# EAGLE schematic Schematic_part2 (EAGLE 9.7.0)

## Sheet 1 of 3
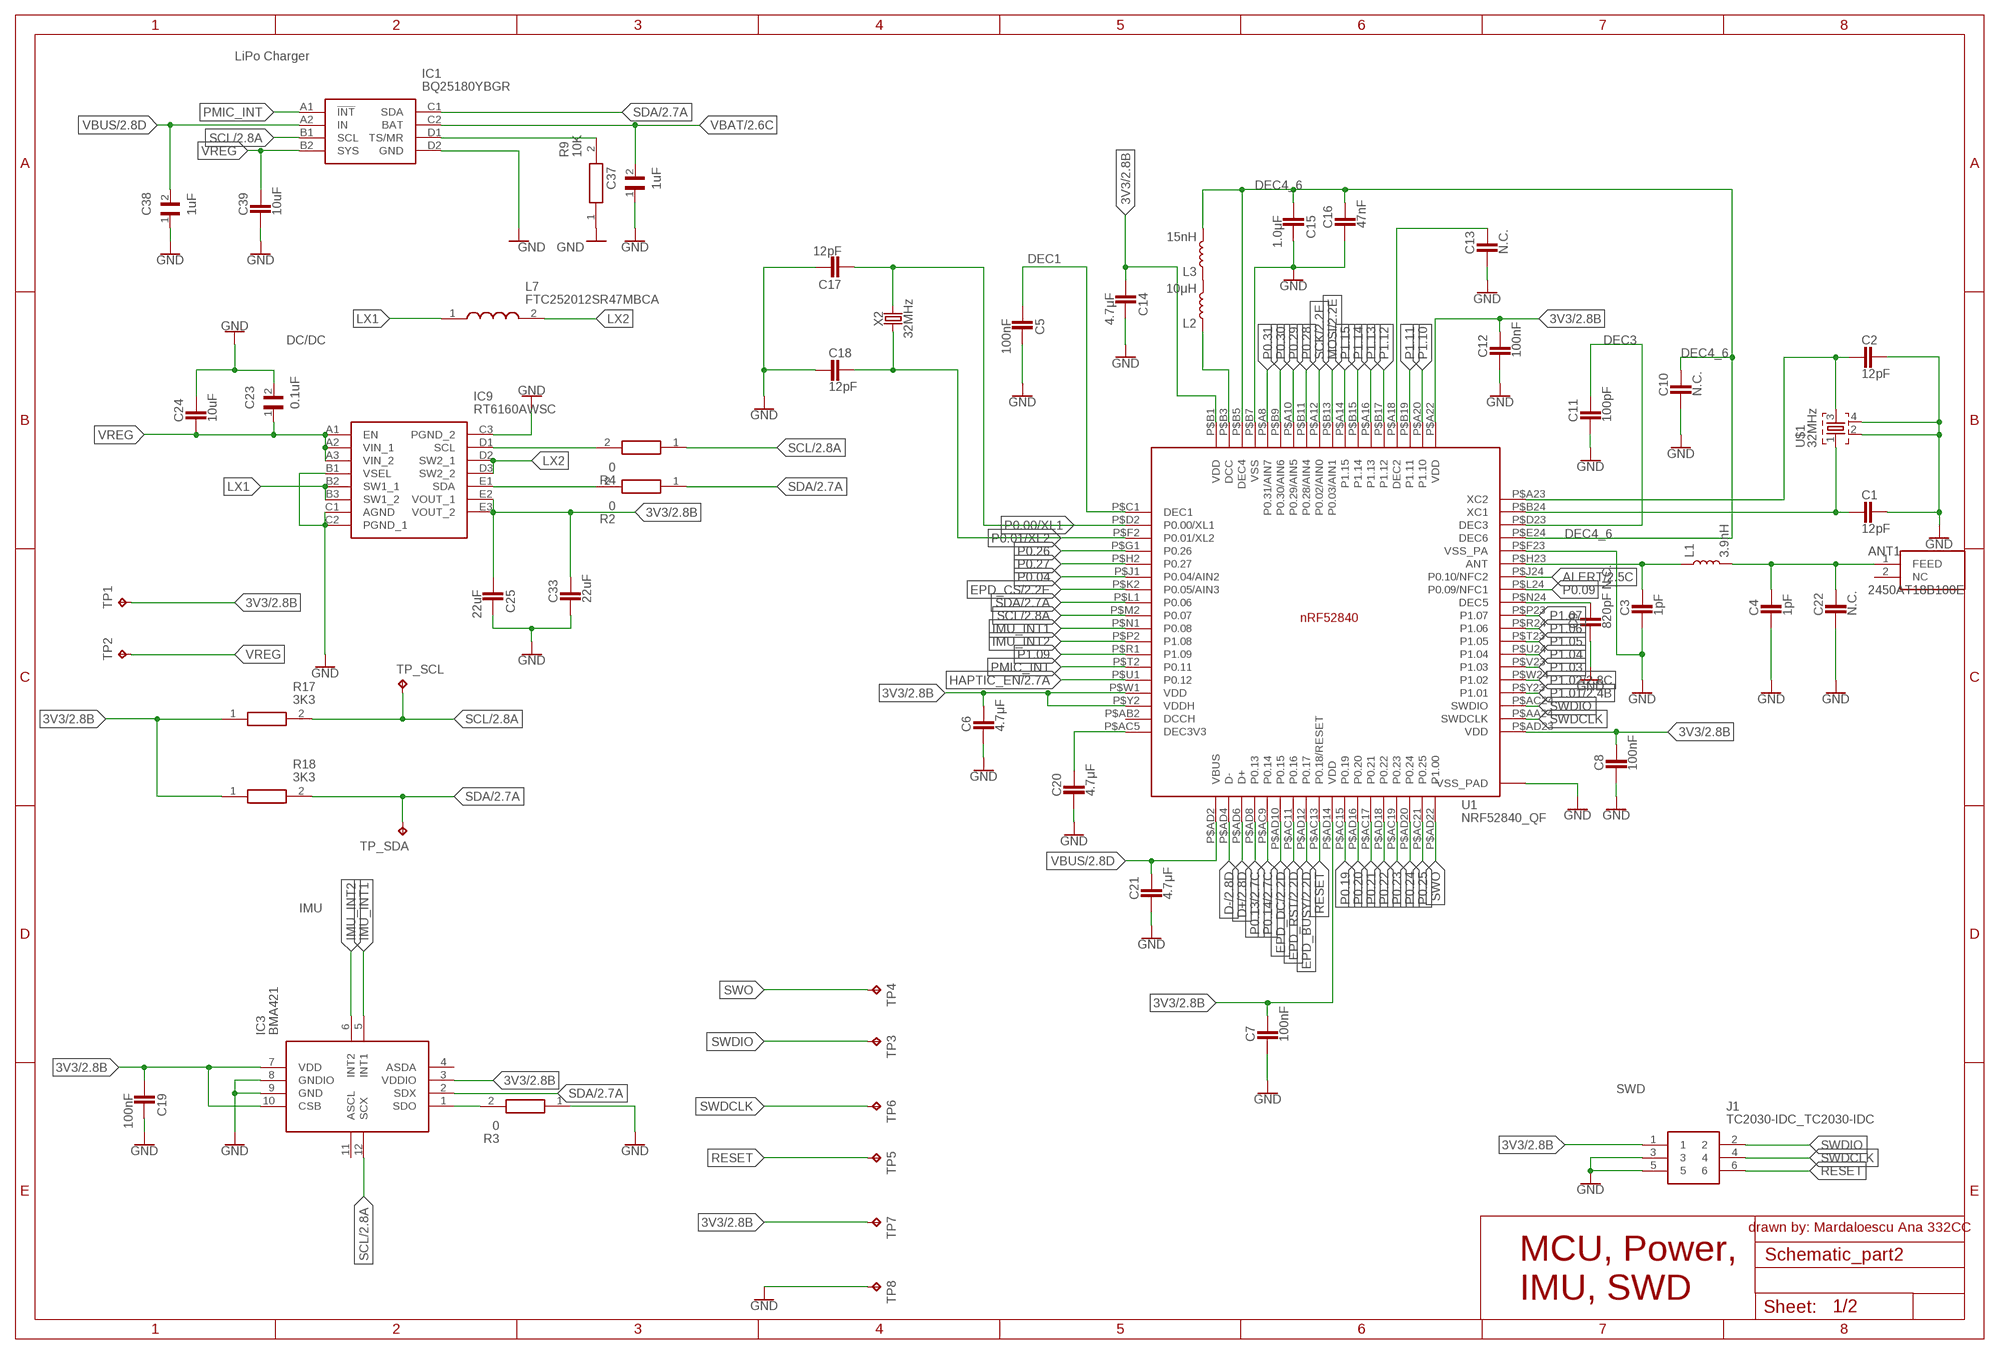
[diagram p0: schematic, sheet 1]

### Parts
ANT1  2450AT18B100E  2450AT18B100E_2450AT18B100E  [2450AT18B100E_ANTC3216X140N]
C1  12pF  CAPACITOR_CHIP-0402(1005-METRIC)  [CAPC1005X60]
C2  12pF  CAPACITOR_CHIP-0402(1005-METRIC)  [CAPC1005X60]
C3  1pF  CAPACITOR_CHIP-0402(1005-METRIC)  [CAPC1005X60]
C4  1pF  CAPACITOR_CHIP-0402(1005-METRIC)  [CAPC1005X60]
C5  100nF  CAPACITOR_CHIP-0402(1005-METRIC)  [CAPC1005X60]
C6  4.7μF  CAPACITOR_CHIP-0402(1005-METRIC)  [CAPC1005X60]
C7  100nF  CAPACITOR_CHIP-0402(1005-METRIC)  [CAPC1005X60]
C8  100nF  CAPACITOR_CHIP-0402(1005-METRIC)  [CAPC1005X60]
C9  820pF N.C.  CAPACITOR_CHIP-0402(1005-METRIC)  [CAPC1005X60]
C10  N.C.  CAPACITOR_CHIP-0402(1005-METRIC)  [CAPC1005X60]
C11  100pF  CAPACITOR_CHIP-0402(1005-METRIC)  [CAPC1005X60]
C12  100nF  CAPACITOR_CHIP-0402(1005-METRIC)  [CAPC1005X60]
C13  N.C.  CAPACITOR_CHIP-0402(1005-METRIC)  [CAPC1005X60]
C14  4.7μF  CAPACITOR_CHIP-0402(1005-METRIC)  [CAPC1005X60]
C15  1.0μF  CAPACITOR_CHIP-0402(1005-METRIC)  [CAPC1005X60]
C16  47nF  CAPACITOR_CHIP-0402(1005-METRIC)  [CAPC1005X60]
C17  12pF  CAPACITOR_CHIP-0402(1005-METRIC)  [CAPC1005X60]
C18  12pF  CAPACITOR_CHIP-0402(1005-METRIC)  [CAPC1005X60]
C19  100nF  CAPACITOR_CHIP-0402(1005-METRIC)  [CAPC1005X60]
C20  4.7μF  CAPACITOR_CHIP-0402(1005-METRIC)  [CAPC1005X60]
C21  4.7μF  CAPACITOR_CHIP-0402(1005-METRIC)  [CAPC1005X60]
C22  N.C.  CAPACITOR_CHIP-0402(1005-METRIC)  [CAPC1005X60]
C23  0.1uF  GRM011R60J152KE01L_1_GRM011R60J152KE01L  [GRM011R60J152KE01L_1_0201]
C24  10uF  CAPACITOR_CHIP-0402(1005-METRIC)  [CAPC1005X60]
C25  22uF  CAPACITOR_CHIP-0402(1005-METRIC)  [CAPC1005X60]
C33  22uF  CAPACITOR_CHIP-0402(1005-METRIC)  [CAPC1005X60]
C37  1uF  GRM011R60J152KE01L_1_GRM011R60J152KE01L  [GRM011R60J152KE01L_1_0201]
C38  1uF  GRM011R60J152KE01L_1_GRM011R60J152KE01L  [GRM011R60J152KE01L_1_0201]
C39  10uF  CAPACITOR_CHIP-0402(1005-METRIC)  [CAPC1005X60]
IC1  BQ25180YBGR  BQ25180YBGR_BQ25180YBGR  [BQ25180YBGR_BGA8C40P2X4_100X155X50]
IC3  BMA421  BMA423_BMA423  [BMA423_BMA423]
IC9  RT6160AWSC  RT6160AWSC_RT6160AWSC  [RT6160AWSC_BGA15C40P3X5_140X230X60]
J1  TC2030-IDC_TC2030-IDC  [TC2030-IDC_TC2030IDC]
L1  3.9nH  1.0μH-0805_WIDE-1.0μH-1.4A-0.07OHM-1.4MM_H  [0805-WIDE]
L2  10μH  1.0μH-0805_WIDE-1.0μH-1.4A-0.07OHM-1.4MM_H  [0805-WIDE]
L3  15nH  1.0μH-0805_WIDE-1.0μH-1.4A-0.07OHM-1.4MM_H  [0805-WIDE]
L7  FTC252012SR47MBCA  MLP2016SR47MT0S1_FTC252012SR47MBCA  [MLP2016SR47MT0S1_INDC2016X100N]
R2  0  CPF0201D7K68C1_CPF0201D7K68C1  [CPF0201D7K68C1_0201]
R3  0  CPF0201D7K68C1_CPF0201D7K68C1  [CPF0201D7K68C1_0201]
R4  0  CPF0201D7K68C1_CPF0201D7K68C1  [CPF0201D7K68C1_0201]
R9  10K  CPF0201D7K68C1_CPF0201D7K68C1  [CPF0201D7K68C1_0201]
R17  3K3  CPF0201D7K68C1_CPF0201D7K68C1  [CPF0201D7K68C1_0201]
R18  3K3  CPF0201D7K68C1_CPF0201D7K68C1  [CPF0201D7K68C1_0201]
TP1  HECTOR_WATCH_1_TPTP20R  [HECTOR_WATCH_1_TP20R]
TP2  HECTOR_WATCH_1_TPTP20R  [HECTOR_WATCH_1_TP20R]
TP3  HECTOR_WATCH_1_TPTP20R  [HECTOR_WATCH_1_TP20R]
TP4  HECTOR_WATCH_1_TPTP20R  [HECTOR_WATCH_1_TP20R]
TP5  HECTOR_WATCH_1_TPTP20R  [HECTOR_WATCH_1_TP20R]
TP6  HECTOR_WATCH_1_TPTP20R  [HECTOR_WATCH_1_TP20R]
TP7  HECTOR_WATCH_1_TPTP20R  [HECTOR_WATCH_1_TP20R]
TP8  HECTOR_WATCH_1_TPTP20R  [HECTOR_WATCH_1_TP20R]
TP_SCL  HECTOR_WATCH_1_TPTP20R  [HECTOR_WATCH_1_TP20R]
TP_SDA  HECTOR_WATCH_1_TPTP20R  [HECTOR_WATCH_1_TP20R]
U1  NRF52840_QF  NORDIC_NRF_4_NRF52840_QF  [NORDIC_NRF_4_AQFN50P700X700X85_HS-74N]
U$1  32MHz  NORDIC_NRF_XTAL_32MHZ  [NORDIC_NRF_BT-XTAL_2016_N]
X2  32MHz  CRYSTAL-32MHZ-SMD-2.0X1.6MM  [CRYSTAL-SMD-2.0X1.6MM]

### Nets
3V3: C6.1 C7.1 C8.1 C12.1 C14.2 C19.2 C25.2 C33.1 IC3.3(VDDIO) IC3.7(VDD) IC3.10(CSB) IC9.E2(VOUT_1) IC9.E3(VOUT_2) J1.1 R17.1 R18.1 TP1.TP TP7.TP U1.P$A22(VDD) U1.P$AD14(VDD) U1.P$AD23(VDD) U1.P$B1(VDD) U1.P$W1(VDD) U1.P$Y2(VDDH) ; also sheet 2
ALERT: U1.P$J24(P0.10/NFC2) ; also sheet 2
D+: U1.P$AD6(D+) ; also sheet 2
D-: U1.P$AD4(D-) ; also sheet 2
DEC1: C5.2 U1.P$C1(DEC1)
DEC3: C11.1 U1.P$D23(DEC3)
DEC4_6: C10.1 C15.2 C16.1 L3.2 U1.P$B5(DEC4) U1.P$E24(DEC6)
EPD_BUSY: U1.P$AD12(P0.17) ; also sheet 2
EPD_CS: U1.P$K2(P0.05/AIN3) ; also sheet 2
EPD_DC: U1.P$AD10(P0.15) ; also sheet 2
EPD_RST: U1.P$AC11(P0.16) ; also sheet 2
GND: C1.1 C2.1 C3.2 C4.2 C5.1 C6.2 C7.2 C8.2 C9.2 C10.2 C11.2 C12.2 C13.2 C14.1 C15.1 C16.2 C17.1 C18.2 C19.1 C20.2 C21.2 C22.2 C23.2 C24.1 C25.1 C33.2 C37.1 C38.1 C39.2 IC1.D2(GND) IC3.8(GNDIO) IC3.9(GND) IC9.B1(VSEL) IC9.C1(AGND) IC9.C2(PGND_1) IC9.C3(PGND_2) J1.3 J1.5 R3.1 R9.1 TP8.TP U1.P$74(VSS_PAD) U1.P$75(VSS_PAD) U1.P$76(VSS_PAD) U1.P$77(VSS_PAD) U1.P$78(VSS_PAD) U1.P$79(VSS_PAD) U1.P$80(VSS_PAD) U1.P$81(VSS_PAD) U1.P$82(VSS_PAD) U1.P$83(VSS_PAD) U1.P$84(VSS_PAD) U1.P$85(VSS_PAD) U1.P$86(VSS_PAD) U1.P$87(VSS_PAD) U1.P$88(VSS_PAD) U1.P$89(VSS_PAD) U1.P$90(VSS_PAD) U1.P$B7(VSS) U1.P$F23(VSS_PA) U$1.2 U$1.4 ; also sheet 2
HAPTIC_EN: U1.P$U1(P0.12) ; also sheet 2
IMU_INT1: IC3.5(INT1) U1.P$N1(P0.08)
IMU_INT2: IC3.6(INT2) U1.P$P2(P1.08)
LX1: IC9.B2(SW1_1) IC9.B3(SW1_2) L7.1
LX2: IC9.D2(SW2_1) IC9.D3(SW2_2) L7.2
MOSI: U1.P$B13(P0.03/AIN1) ; also sheet 2
N$1: IC9.D1(SCL) R4.2
N$2: IC9.E1(SDA) R2.2
N$3: IC3.1(SDO) R3.2
N$4: C3.1 L1.1 U1.P$H23(ANT)
N$5: ANT1.1(FEED) C4.1 C22.1 L1.2
N$7: IC1.D1(TS/MR) R9.2
N$10: C9.1 U1.P$N24(DEC5)
N$38: C20.1 U1.P$AC5(DEC3V3)
N$56: L2.2 L3.1
N$57: L2.1 U1.P$B3(DCC)
N$71: C13.1 U1.P$A18(DEC2)
N$74: C2.2 U1.P$A23(XC2) U$1.3
N$75: C1.2 U1.P$B24(XC1) U$1.1
P0.00/XL1: C17.2 U1.P$D2(P0.00/XL1) X2.3
P0.01/XL2: C18.1 U1.P$F2(P0.01/XL2) X2.1
P0.04: U1.P$J1(P0.04/AIN2)
P0.09: U1.P$L24(P0.09/NFC1)
P0.13: U1.P$AD8(P0.13) ; also sheet 2
P0.14: U1.P$AC9(P0.14) ; also sheet 2
P0.19: U1.P$AC15(P0.19)
P0.20: U1.P$AD16(P0.20)
P0.21: U1.P$AC17(P0.21)
P0.22: U1.P$AD18(P0.22)
P0.23: U1.P$AC19(P0.23)
P0.24: U1.P$AD20(P0.24)
P0.25: U1.P$AC21(P0.25)
P0.26: U1.P$G1(P0.26)
P0.27: U1.P$H2(P0.27)
P0.28: U1.P$B11(P0.28/AIN4)
P0.29: U1.P$A10(P0.29/AIN5)
P0.30: U1.P$B9(P0.30/AIN6)
P0.31: U1.P$A8(P0.31/AIN7)
P1.01: U1.P$Y23(P1.01) ; also sheet 2
P1.02: U1.P$W24(P1.02) ; also sheet 2
P1.03: U1.P$V23(P1.03)
P1.04: U1.P$U24(P1.04)
P1.05: U1.P$T23(P1.05)
P1.06: U1.P$R24(P1.06)
P1.07: U1.P$P23(P1.07)
P1.09: U1.P$R1(P1.09)
P1.10: U1.P$A20(P1.10)
P1.11: U1.P$B19(P1.11)
P1.12: U1.P$B17(P1.12)
P1.13: U1.P$A16(P1.13)
P1.14: U1.P$B15(P1.14)
P1.15: U1.P$A14(P1.15)
PMIC_INT: IC1.A1(!INT) U1.P$T2(P0.11)
RESET: J1.6 TP5.TP U1.P$AC13(P0.18/RESET)
SCK: U1.P$A12(P0.02/AIN0) ; also sheet 2
SCL: IC1.B1(SCL) IC3.12(SCX) R4.1 R17.2 TP_SCL.TP U1.P$M2(P0.07) ; also sheet 2
SDA: IC1.C1(SDA) IC3.2(SDX) R2.1 R18.2 TP_SDA.TP U1.P$L1(P0.06) ; also sheet 2
SWDCLK: J1.4 TP6.TP U1.P$AA24(SWDCLK)
SWDIO: J1.2 TP3.TP U1.P$AC24(SWDIO)
SWO: TP4.TP U1.P$AD22(P1.00)
VBAT: C37.2 IC1.C2(BAT) ; also sheet 2
VBUS: C21.1 C38.2 IC1.A2(IN) U1.P$AD2(VBUS) ; also sheet 2
VREG: C23.1 C24.2 C39.1 IC1.B2(SYS) IC9.A1(EN) IC9.A2(VIN_1) IC9.A3(VIN_2) TP2.TP
Unconnected: ANT1.2(NC) IC3.4(ASDA) IC3.11(ASCL) U1.P$AB2(DCCH)

### Notes on the sheet
- LiPo Charger
- DC/DC
- IMU
- SWD
- drawn by: Mardaloescu Ana 332CC
- MCU, Power,
  IMU, SWD
- Sheet: | 1/2

## Sheet 2 of 3
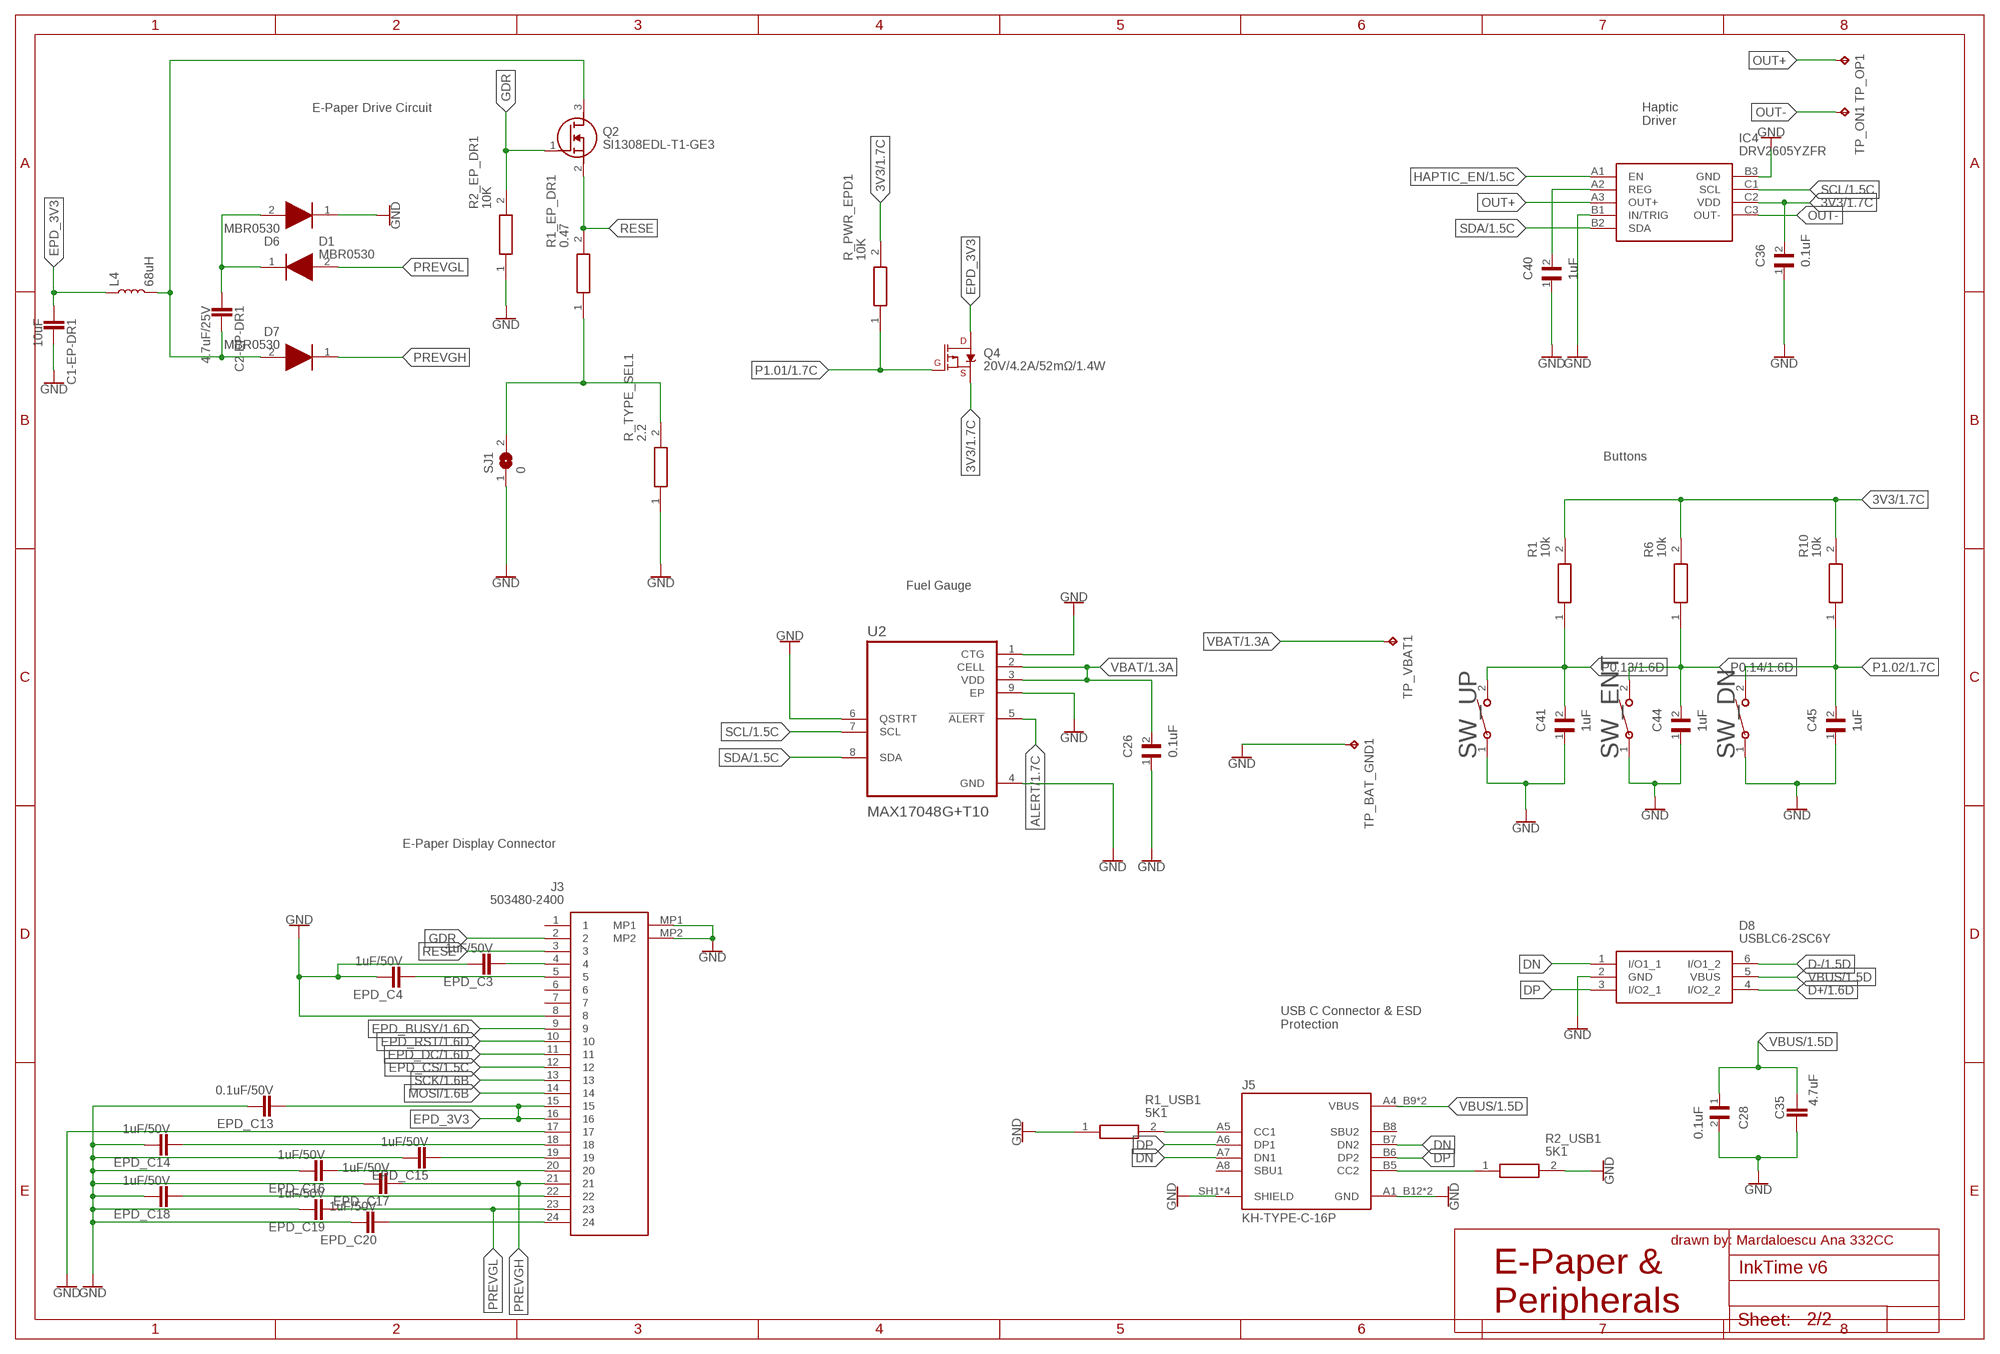
[diagram p1: schematic, sheet 2]

### Parts
C1-EP-DR1  10uF  CAPACITOR_CHIP-0402(1005-METRIC)  [CAPC1005X60]
C2-EP-DR1  4.7uF/25V  CAPACITOR_CHIP-0402(1005-METRIC)  [CAPC1005X60]
C26  0.1uF  GRM011R60J152KE01L_1_GRM011R60J152KE01L  [GRM011R60J152KE01L_1_0201]
C28  0.1uF  GRM011R60J152KE01L_1_GRM011R60J152KE01L  [GRM011R60J152KE01L_1_0201]
C35  4.7uF  CAPACITOR_CHIP-0402(1005-METRIC)  [CAPC1005X60]
C36  0.1uF  GRM011R60J152KE01L_1_GRM011R60J152KE01L  [GRM011R60J152KE01L_1_0201]
C40  1uF  GRM011R60J152KE01L_1_GRM011R60J152KE01L  [GRM011R60J152KE01L_1_0201]
C41  1uF  GRM011R60J152KE01L_1_GRM011R60J152KE01L  [GRM011R60J152KE01L_1_0201]
C44  1uF  GRM011R60J152KE01L_1_GRM011R60J152KE01L  [GRM011R60J152KE01L_1_0201]
C45  1uF  GRM011R60J152KE01L_1_GRM011R60J152KE01L  [GRM011R60J152KE01L_1_0201]
D1  MBR0530  ESP32_C6_LIBRARY_5_MBR0530  [ESP32_C6_LIBRARY_5_SOD3716X135N]
D6  MBR0530  ESP32_C6_LIBRARY_5_MBR0530  [ESP32_C6_LIBRARY_5_SOD3716X135N]
D7  MBR0530  ESP32_C6_LIBRARY_5_MBR0530  [ESP32_C6_LIBRARY_5_SOD3716X135N]
D8  USBLC6-2SC6Y  ESP32_C6_LIBRARY_3_USBLC6-2SC6Y  [ESP32_C6_LIBRARY_3_SOT95P280X145-6N]
EPD_C3  1uF/50V  CAPACITOR_CHIP-0402(1005-METRIC)  [CAPC1005X60]
EPD_C4  1uF/50V  CAPACITOR_CHIP-0402(1005-METRIC)  [CAPC1005X60]
EPD_C13  0.1uF/50V  CAPACITOR_CHIP-0402(1005-METRIC)  [CAPC1005X60]
EPD_C14  1uF/50V  CAPACITOR_CHIP-0402(1005-METRIC)  [CAPC1005X60]
EPD_C15  1uF/50V  CAPACITOR_CHIP-0402(1005-METRIC)  [CAPC1005X60]
EPD_C16  1uF/50V  CAPACITOR_CHIP-0402(1005-METRIC)  [CAPC1005X60]
EPD_C17  1uF/50V  CAPACITOR_CHIP-0402(1005-METRIC)  [CAPC1005X60]
EPD_C18  1uF/50V  CAPACITOR_CHIP-0402(1005-METRIC)  [CAPC1005X60]
EPD_C19  1uF/50V  CAPACITOR_CHIP-0402(1005-METRIC)  [CAPC1005X60]
EPD_C20  1uF/50V  CAPACITOR_CHIP-0402(1005-METRIC)  [CAPC1005X60]
IC4  DRV2605YZFR  DRV2605YZFR_DRV2605YZFR  [DRV2605YZFR_BGA9C50P3X3_144X144X62]
J3  503480-2400  503480-2400_503480-2400  [503480-2400_5034802400]
J5  KH-TYPE-C-16P  KH-TYPE-C-16P_KH-TYPE-C-16P  [KH-TYPE-C-16P_KINGHELM_KH-TYPE-C-16P]
L4  68uH  INDUCTOR-XFL40201.5UH  [XFL4020]
Q2  SI1308EDL-T1-GE3  ESP32_C6_LIBRARY_6_SI1308EDL-T1-GE3  [ESP32_C6_LIBRARY_6_SOT65P210X110-3N]
Q4  20V/4.2A/52mΩ/1.4W  ESP32_C6_LIBRARY_4_ESP32_WROVER_SPARKFUN-DISCRETESEMI_MOSFET_PCH-DMG2305UX-7  [ESP32_C6_LIBRARY_4_ESP32_C6_LIBRARY_4_ESP32_C6_LIBRARY_4_ESP32_C6_LIBRARY_4_ESP32_WROVER_SPARKFUN-DISCRETESEMI_SOT23-3]
R1  10k  CPF0201D7K68C1_CPF0201D7K68C1  [CPF0201D7K68C1_0201]
R1_EP_DR1  0.47  CPF0201D7K68C1_CPF0201D7K68C1  [CPF0201D7K68C1_0201]
R1_USB1  5K1  CPF0201D7K68C1_CPF0201D7K68C1  [CPF0201D7K68C1_0201]
R2_EP_DR1  10K  CPF0201D7K68C1_CPF0201D7K68C1  [CPF0201D7K68C1_0201]
R2_USB1  5K1  CPF0201D7K68C1_CPF0201D7K68C1  [CPF0201D7K68C1_0201]
R6  10k  CPF0201D7K68C1_CPF0201D7K68C1  [CPF0201D7K68C1_0201]
R10  10k  CPF0201D7K68C1_CPF0201D7K68C1  [CPF0201D7K68C1_0201]
R_PWR_EPD1  10K  CPF0201D7K68C1_CPF0201D7K68C1  [CPF0201D7K68C1_0201]
R_TYPE_SEL1  2.2  CPF0201D7K68C1_CPF0201D7K68C1  [CPF0201D7K68C1_0201]
SJ1  0  ESP32_C6_LIBRARY_7_JUMPER_SJ  [ESP32_C6_LIBRARY_7_JUMPER_SJ]
SW_DN  2025-10-22_07-23-44_LIBRARY_EVP-AKE31ASW_EVP-AKE31A_PAN  [2025-10-22_07-23-44_LIBRARY_SW_EVP-AKE31A_PAN]
SW_ENT  2025-10-22_07-23-44_LIBRARY_EVP-AKE31ASW_EVP-AKE31A_PAN  [2025-10-22_07-23-44_LIBRARY_SW_EVP-AKE31A_PAN]
SW_UP  2025-10-22_07-23-44_LIBRARY_EVP-AKE31ASW_EVP-AKE31A_PAN  [2025-10-22_07-23-44_LIBRARY_SW_EVP-AKE31A_PAN]
TP_BAT_GND1  HECTOR_WATCH_1_TPTP20R  [HECTOR_WATCH_1_TP20R]
TP_ON1  HECTOR_WATCH_1_TPTP20R  [HECTOR_WATCH_1_TP20R]
TP_OP1  HECTOR_WATCH_1_TPTP20R  [HECTOR_WATCH_1_TP20R]
TP_VBAT1  HECTOR_WATCH_1_TPTP20R  [HECTOR_WATCH_1_TP20R]
U2  MAX17048G+T10  ESP32_C6_LIBRARY_MAX17048G+T10  [ESP32_C6_LIBRARY_SON50P200X200X80-9N]

### Nets
3V3: C36.2 IC4.C2(VDD) Q4.2(S) R1.2 R6.2 R10.2 R_PWR_EPD1.2 ; also sheet 1
3V3/1.7D2: C40.2 IC4.A2(REG)
ALERT: U2.5(!ALERT) ; also sheet 1
D+: D8.4(I/O2_2) ; also sheet 1
D-: D8.6(I/O1_2) ; also sheet 1
DN: D8.1(I/O1_1) J5.A7(DN1) J5.B7(DN2)
DP: D8.3(I/O2_1) J5.A6(DP1) J5.B6(DP2)
EPD_3V3: C1-EP-DR1.2 EPD_C13.2 J3.15 J3.16 L4.P$1 Q4.3(D)
EPD_BUSY: J3.9 ; also sheet 1
EPD_CS: J3.12 ; also sheet 1
EPD_DC: J3.11 ; also sheet 1
EPD_RST: J3.10 ; also sheet 1
GDR: J3.2 Q2.1(G) R2_EP_DR1.2
GND: C1-EP-DR1.1 C26.1 C28.2 C35.2 C36.1 C40.1 C41.1 C44.1 C45.1 D6.1(K) D8.2(GND) EPD_C3.1 EPD_C4.1 EPD_C13.1 EPD_C14.1 EPD_C15.1 EPD_C16.1 EPD_C17.1 EPD_C18.1 EPD_C19.1 EPD_C20.1 IC4.B1(IN/TRIG) IC4.B3(GND) J3.8 J3.17 J3.MP1 J3.MP2 J5.A1_B12(GND) J5.A12_B1(GND) J5.SH1(SHIELD) J5.SH2(SHIELD) J5.SH3(SHIELD) J5.SH4(SHIELD) R1_USB1.1 R2_EP_DR1.1 R2_USB1.2 R_TYPE_SEL1.1 SJ1.1 SW_DN.1 SW_ENT.1 SW_UP.1 TP_BAT_GND1.TP U2.1(CTG) U2.4(GND) U2.6(QSTRT) U2.9(EP) ; also sheet 1
HAPTIC_EN: IC4.A1(EN) ; also sheet 1
MOSI: J3.14 ; also sheet 1
N$22: C2-EP-DR1.1 D7.2(A) L4.P$2 Q2.3(D)
N$23: R1_EP_DR1.1 R_TYPE_SEL1.2 SJ1.2
N$24: C2-EP-DR1.2 D1.1(K) D6.2(A)
N$25: EPD_C3.2 J3.4
N$26: EPD_C4.2 J3.5
N$27: EPD_C14.2 J3.18
N$28: EPD_C15.2 J3.19
N$29: EPD_C16.2 J3.20
N$30: EPD_C18.2 J3.22
N$31: EPD_C20.2 J3.24
N$32: J5.A5(CC1) R1_USB1.2
N$33: J5.B5(CC2) R2_USB1.1
OUT+: IC4.A3(OUT+) TP_OP1.TP
OUT-: IC4.C3(OUT-) TP_ON1.TP
P0.13: C41.2 R1.1 SW_UP.2 ; also sheet 1
P0.14: C44.2 R6.1 SW_ENT.2 ; also sheet 1
P1.01: Q4.1(G) R_PWR_EPD1.1 ; also sheet 1
P1.02: C45.2 R10.1 SW_DN.2 ; also sheet 1
PREVGH: D7.1(K) EPD_C17.2 J3.21
PREVGL: D1.2(A) EPD_C19.2 J3.23
RESE: J3.3 Q2.2(S) R1_EP_DR1.2
SCK: J3.13 ; also sheet 1
SCL: IC4.C1(SCL) U2.7(SCL) ; also sheet 1
SDA: IC4.B2(SDA) U2.8(SDA) ; also sheet 1
VBAT: C26.2 TP_VBAT1.TP U2.2(CELL) U2.3(VDD) ; also sheet 1
VBUS: C28.1 C35.1 D8.5(VBUS) J5.A4_B9(VBUS) J5.A9_B4(VBUS) ; also sheet 1
Unconnected: J3.1 J3.6 J3.7 J5.A8(SBU1) J5.B8(SBU2)

### Notes on the sheet
- E-Paper Drive Circuit
- Haptic
  Driver
- Buttons
- Fuel Gauge
- E-Paper Display Connector
- USB C Connector & ESD
  Protection
- drawn by: Mardaloescu Ana 332CC
- InkTime v6
- E-Paper &
  Peripherals
- Sheet: | 2/2

## Sheet 3 of 3

## Library data of the parts
ANT1 = InkTime_v5:2450AT18B100E_2450AT18B100E: Antennas 2.45GHz ANTENNA Source: Datasheet <https://www.johansontechnology.com/datasheets/2450AT18B100/2450AT18B100.pdf>
C1 C1-EP-DR1 C2 C2-EP-DR1 C3-C22 C24 C25 C33 C35 C39 EPD_C3 EPD_C4 EPD_C13-EPD_C20 = Tinkercad:CAPACITOR: Capacitor - Generic
C23 C26 C28 C36-C38 C40 C41 C44 C45 = InkTime_v5:GRM011R60J152KE01L_1_GRM011R60J152KE01L: Check availability <https://pricing.snapeda.com/parts/GRM011R60J152KE01L/Murata/view-part?ref=eda>
D1 D6 D7 = InkTime_v5:ESP32_C6_LIBRARY_5_MBR0530: ON SEMICONDUCTOR - MBR0530 - DIODE, SCHOTTKY, 0.5A, 30V, SOD-123 Source: Datasheet <http://www.onsemi.com/pub/Collateral/MBR0530T1-D.PDF> Check availability <https://pricing.snapeda.com/parts/MBR0530/ON%20Semiconductor/view-part?ref=eda>
D8 = InkTime_v5:ESP32_C6_LIBRARY_3_USBLC6-2SC6Y: Low Cap. ESD Protection Auto SOT-23-6 STMicroelectronics USBLC6-2SC6Y, Dual Uni-Directional TVS Diode Array, 6-Pin SOT-23 Source: Datasheet <https://componentsearchengine.com/Datasheets/1/USBLC6-2SC6Y.pdf> Check availability <https://pricing.snapeda.com/parts/USBLC6-2SC6Y/STMicroelectronics/view-part?ref=eda>
IC1 = InkTime_v5:BQ25180YBGR_BQ25180YBGR: Charger IC Lithium Ion/Polymer, Lithium Iron Phosphate 8-DSBGA (1.6x1.1) Source: Datasheet <https://www.ti.com/lit/ds/symlink/bq25180.pdf?ts=1650264094470&ref_url=https%3A%2F%2Fwww.ti.com%2Fproduct%2FBQ25180>
IC3 = InkTime_v5:BMA423_BMA423: Accelerometers Triaxial low-g 12bit Acceleration Sensor Source: Datasheet <https://www.mouser.com/datasheet/2/783/BST-BMA423-DS000-1509600.pdf>
IC4 = InkTime_v5:DRV2605YZFR_DRV2605YZFR: Haptic Driver for ERM/LRA with Built-In Library and Smart Loop Architecture Source: Datasheet <http://www.ti.com/lit/gpn/drv2605>
IC9 = InkTime_v5:RT6160AWSC_RT6160AWSC: Buck-Boost Regulator Positive Output Step-Up/Step-Down I2C DC-DC Controller IC 15-WL-CSP (BSC) (1.4x2.3) Source: Datasheet <https://www.richtek.com/SaveDownload.aspx?specid=RT6160A>
J1 = InkTime_v5:TC2030-IDC_TC2030-IDC: CABLE ADAPTER 6 POS Source: Datasheet <https://datasheet.datasheetarchive.com/originals/distributors/Datasheets_SAMA/62bc384e093448baaaa63dbd0b9d8707.pdf>
J3 = InkTime_v5:503480-2400_503480-2400: FFC & FPC Connectors 0.5mm FPC RA SMT Dual Contact 24Ckt Source: Datasheet <https://componentsearchengine.com/Datasheets/1/503480-2400.pdf>
J5 = InkTime_v5:KH-TYPE-C-16P_KH-TYPE-C-16P: Check availability <https://pricing.snapeda.com/parts/KH-TYPE-C-16P/kinghelm/view-part?ref=eda>
L1-L3 = SparkFun-Coils:1.0μH: 1.0μH Inductor Resist changes in electrical current. Basically a coil of wire. SparkFun Products: SparkFun Edge <https://www.sparkfun.com/products/15170>
L4 = SparkFun-Coils:INDUCTOR-XFL4020
L7 = InkTime_v5:MLP2016SR47MT0S1_FTC252012SR47MBCA: SMD / SMT Inductors (Coils), L=0.47?H, L x W x T : Source: Datasheet <https://product.tdk.com/system/files/dam/doc/product/inductor/inductor/smd/catalog/inductor_commercial_power_mlp2016_en.pdf>
Q2 = InkTime_v5:ESP32_C6_LIBRARY_6_SI1308EDL-T1-GE3: MOSFET N-Ch 30V 1.5A TrenchFET SC70 Vishay Si1308EDL-T1-GE3 N-channel MOSFET Transistor, 1.5 A, 30 V, 3-Pin SC-70 Source: Datasheet <https://componentsearchengine.com/Datasheets/1/SI1308EDL-T1-GE3.pdf> Check availability <https://pricing.snapeda.com/parts/SI1308EDL-T1-GE3/Vishay%20Siliconix/view-part?ref=eda>
Q4 = InkTime_v5:ESP32_C6_LIBRARY_4_ESP32_WROVER_SPARKFUN-DISCRETESEMI_MOSFET_PCH: P-channel MOSFETs Voltage controlled devices that allow control of high current outputs. SparkFun Products: SparkFun ESP32 Thing <https://www.sparkfun.com/products/13907> SparkFun ESP8266 Thing <https://www.sparkfun.com/products/13231> SparkFun Pi Servo HAT V2 <https://www.sparkfun.com/products/15316> DMG2305UX-7 (20V/4.2A/SOT23-3)
R1 R1_EP_DR1 R1_USB1 R2 R2_EP_DR1 R2_USB1 R3 R4 R6 R9 R10 R17 R18 R_PWR_EPD1 R_TYPE_SEL1 = InkTime_v5:CPF0201D7K68C1_CPF0201D7K68C1: 7.68k 0201 Thin Film Surface Mount Fixed Resistor +/-0.5% 0.031W CPF0201D7K68C1 Source: Datasheet <http://www.te.com/commerce/DocumentDelivery/DDEController?Action=showdoc&DocId=Data Sheet1773200-1ApdfEnglishENG_DS_1773200-1_A.pdf4-2176215-6>
SJ1 = InkTime_v5:ESP32_C6_LIBRARY_7_JUMPER_SJ: SMD solder JUMPER
SW_DN SW_ENT SW_UP = InkTime_v5_button fara modifcaturi:2025-10-22_07-23-44_LIBRARY_EVP-AKE31A
TP1-TP8 TP_BAT_GND1 TP_ON1 TP_OP1 TP_SCL TP_SDA TP_VBAT1 = InkTime_v5:HECTOR_WATCH_1_TP: Test pad
U1 = InkTime_v5:NORDIC_NRF_4_NRF52840_QF: nRF52840 Features Advanced Single chip 2.4 GHz multi-protocol SoC 32-bit ARM Cortex-M4F Processor 1.7v to 5.5v operation 1MB flash + 256kB RAM Bluetooth 5 support for long range and high throughput 802.15.4 radio support On-chip NFC PPI –Programmable Peripheral Interconnect Automated power management system with automatic power management of each peripheral Configurable I/O mapping for analog and digital I/O 48 x GPIO 1 x QSPI 4 x Master/Slave SPI 2 x Two-wire interface (I²C) I²S interface 2 x UART 4 x PWM USB 2.0 controller ARM TrustZone CryptoCell-310 Cryptographic and security module AES 128-bit ECB/CCM/AAR hardware accelerator Digital microphone interface (PDM) Quadrature decoder 12-bit ADC Low power comparator On-chip 50Ω balun On-air compatible with nRF52, nRF51 and nRF24 Series Applications Advanced high performance wearables Wearables for secure payments Virtual Reality/Augmented Reality systems Smart Home sensor networks Smart city sensor networks High performance HID controllers Internet of Things (IoT) sensor networks Smart door locks Smart lighting networks Connected white goods
U2 = InkTime_v5:ESP32_C6_LIBRARY_MAX17048G+T10: Check availability <https://pricing.snapeda.com/parts/MAX17048G%2BT10/Analog%20Devices/view-part?ref=eda>
U$1 = InkTime_v5_button fara modifcaturi:NORDIC_NRF_XTAL_32MHZ
X2 = SparkFun-Clocks:CRYSTAL-32MHZ: 32MHz Crystal Digikey Example <http://www.digikey.com/product-detail/en/murata-electronics-north-america/XRCGB32M000F2P00R0/490-9769-1-ND/4952013> Frequency: 32MHz Frequency Stability: ±20ppm Frequency Tolerance: ±20ppm Load Capacitance: 6pF SparkFun Products SparkFun nRF52832 Breakout <https://www.sparkfun.com/products/13990>